# EAGLE design IHM_ADAPT (EAGLE 9.5.2)
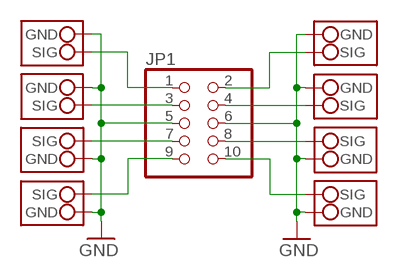
[diagram p0: schematic, sheet 1]

## Parts
JP1  PINHD-2X05_2.54-SMD  [2X05SMD]
U$1  CONN_WIRE  [SMD_WIRE_CON]
U$2  CONN_WIRE  [SMD_WIRE_CON]
U$3  CONN_WIRE  [SMD_WIRE_CON]
U$4  CONN_WIRE  [SMD_WIRE_CON]
U$5  CONN_WIRE  [SMD_WIRE_CON]
U$6  CONN_WIRE  [SMD_WIRE_CON]
U$7  CONN_WIRE  [SMD_WIRE_CON]
U$8  CONN_WIRE  [SMD_WIRE_CON]

## Nets
GND: JP1.5 JP1.6 U$1.P$1(GND) U$2.P$1(GND) U$3.P$1(GND) U$4.P$1(GND) U$5.P$1(GND) U$6.P$1(GND) U$7.P$1(GND) U$8.P$1(GND)
N$1: JP1.10 U$4.P$2(SIG)
N$2: JP1.8 U$2.P$2(SIG)
N$3: JP1.4 U$1.P$2(SIG)
N$4: JP1.2 U$3.P$2(SIG)
N$5: JP1.9 U$8.P$2(SIG)
N$6: JP1.7 U$6.P$2(SIG)
N$7: JP1.3 U$5.P$2(SIG)
N$8: JP1.1 U$7.P$2(SIG)

## Library data of the parts
JP1 = pinhead-2:PINHD-2X05: PIN HEADER
U$1-U$8 = OPENBOT:CONN_WIRE

## Board
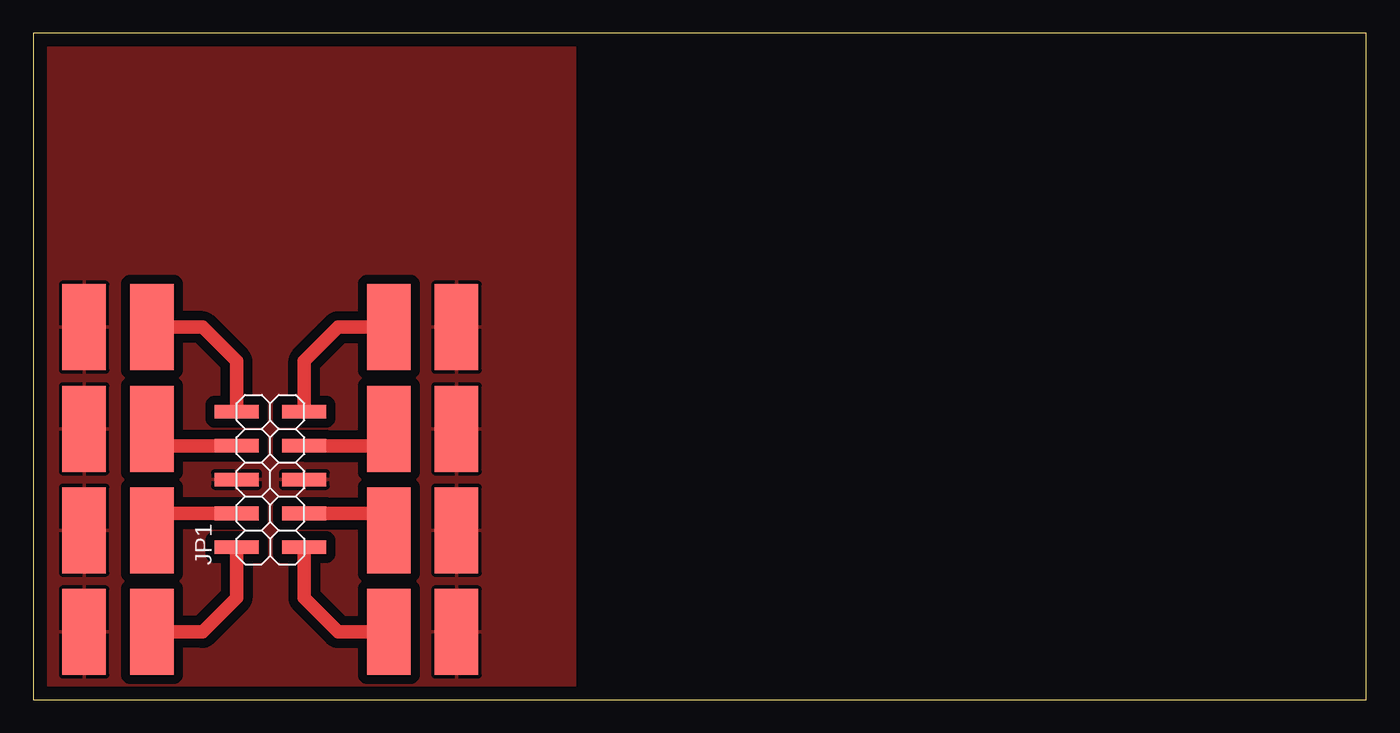
[diagram p1: board, top side]

Size 100 x 50 mm. Coordinates in mm from the lower left corner, seen from the top.
Outline: 0,0 100,0 100,50 0,50 0,0
Copper layers (1*16): Top 0.035mm / dielectric 1.5mm / Bottom 0.035mm
Design rules "default": minimum track width 6mil, minimum drill 0.35mm, track to track 6mil, track to pad 6mil, pad to pad 6mil, via to via 6mil, smd to smd 6mil, copper to edge 40mil, drill to drill 6mil, minimum pad ring 10mil, minimum via ring 8mil, stop-mask expansion 4mil, vias tented up to drill 0mil, thermal gap 10mil

### Footprints (pad centres in the part's own frame; a part is rotated, then mirrored left to right if it is on the bottom)
2X05SMD = smd 1.016 x 3.302: 1 -1.27,-3.81; 2 -1.27,1.27; 3 1.27,-3.81; 4 1.27,1.27; 5 3.81,-3.81; 6 3.81,1.27; 7 6.35,-3.81; 8 6.35,1.27; 9 8.89,-3.81; 10 8.89,1.27
SMD_WIRE_CON = smd 6.452 x 3.251: P$1 0,-2.54; P$2 0,2.54

### Placement (x,y rotation side)
JP1  16.51,12.7 90 top
U$1  6.35,12.7 270 top
U$2  6.35,20.32 270 top
U$3  6.35,5.08 270 top
U$4  6.35,27.94 270 top
U$5  29.21,12.7 90 top
U$6  29.21,20.32 90 top
U$7  29.21,5.08 90 top
U$8  29.21,27.94 90 top

### Tracks (layer width: path | path; a pad name or v marks a point on that pad's centre or on a via)
GND
  pour Top (isolate 0.7): -1.27,52.07 40.64,52.07 40.64,-5.08 -1.27,-5.08
N$1
  Top 1.016: JP1.10 15.24,25.4 12.7,27.94 U$4.P$2
N$2
  Top 1.016: JP1.8 10.16,19.05 U$2.P$2
N$3
  Top 1.016: JP1.4 8.89,13.97 U$1.P$2
N$4
  Top 1.016: JP1.2 15.24,7.62 12.7,5.08 U$3.P$2
N$5
  Top 1.016: U$8.P$2 22.86,27.94 20.32,25.4 JP1.9
N$6
  Top 1.016: JP1.7 26.67,19.05 U$6.P$2
N$7
  Top 1.016: JP1.3 25.4,13.97 U$5.P$2
N$8
  Top 1.016: JP1.1 20.32,7.62 22.86,5.08 U$7.P$2